# Altium schematic sheet Matrix2.SchDoc
size A0
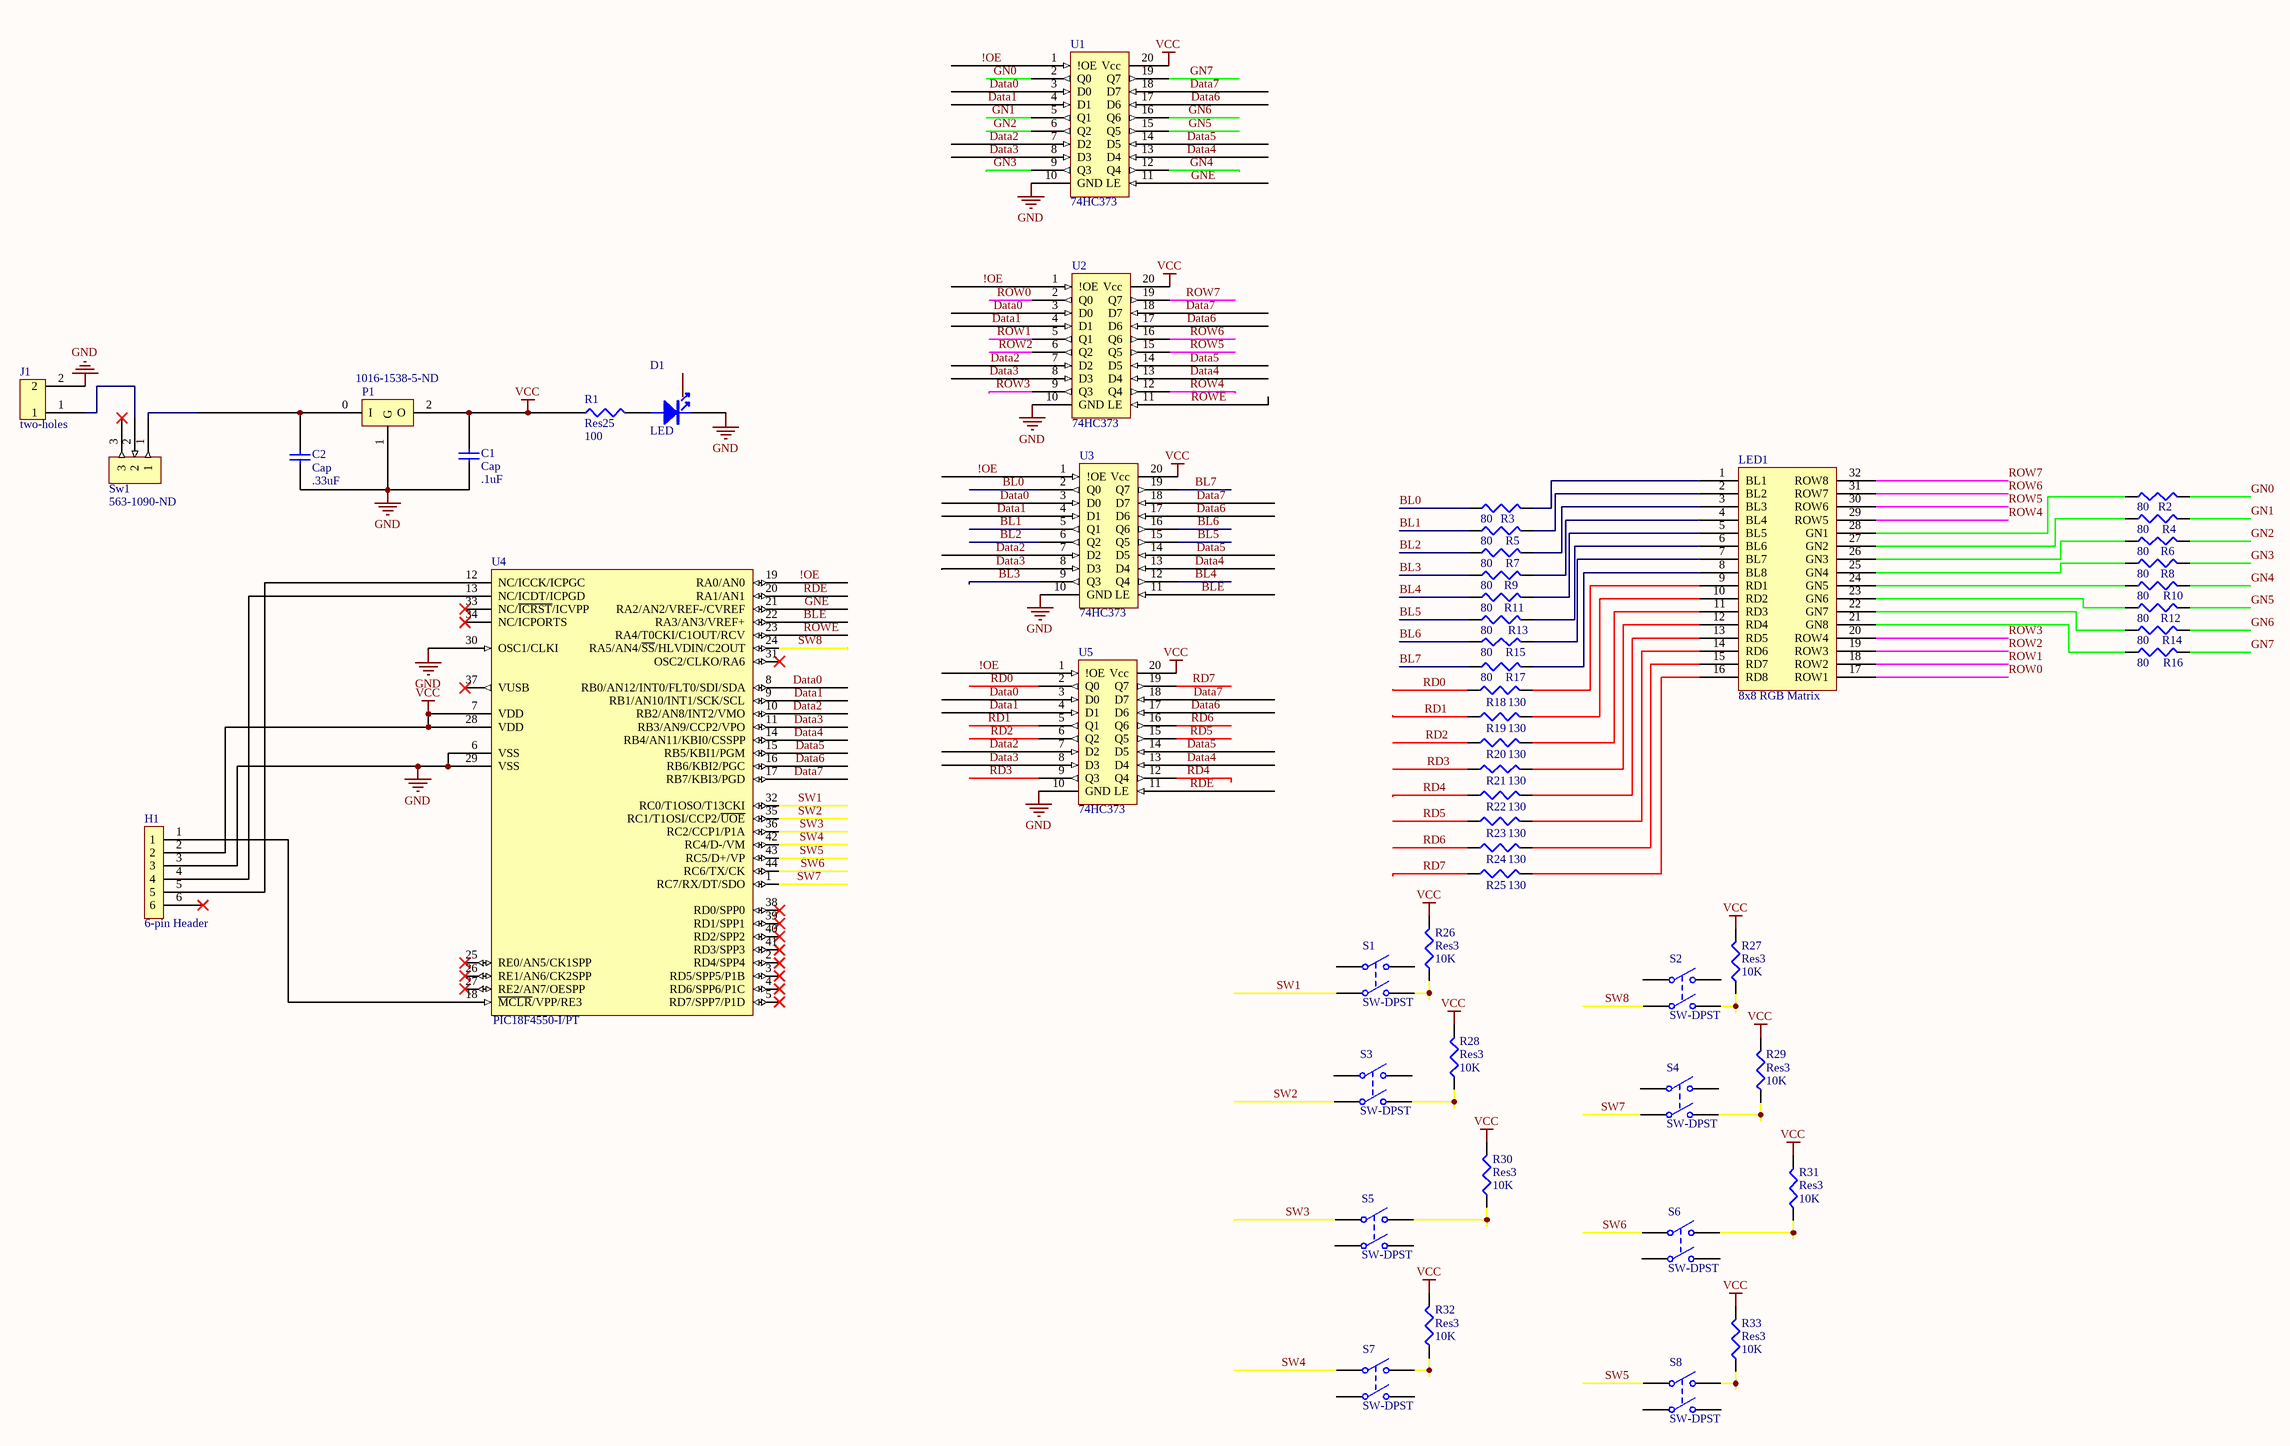
[diagram p0: Matrix2.SchDoc]

## Parts
C1  Cap  value .1uF  [RAD-0.3]
C2  Cap  value .33uF  [RAD-0.3]
D1  LED  [LED-5608F]
H1  6-pin Header  [6-pin Header]
J1  two-holes  [two-holes]
LED1  8x8 RGB Matrix  [8x8 RGB Matrix]
P1  1016-1538-5-ND  [1016-1538-5-ND]
R1  Res25  value 100  [J1-0603]
R2  80  [AXIAL0.5]
R3  80  [AXIAL0.5]
R4  80  [AXIAL0.5]
R5  80  [AXIAL0.5]
R6  80  [AXIAL0.5]
R7  80  [AXIAL0.5]
R8  80  [AXIAL0.5]
R9  80  [AXIAL0.5]
R10  80  [AXIAL0.5]
R11  80  [AXIAL0.5]
R12  80  [AXIAL0.5]
R13  80  [AXIAL0.5]
R14  80  [AXIAL0.5]
R15  80  [AXIAL0.5]
R16  80  [AXIAL0.5]
R17  80  [AXIAL0.5]
R18  value 130  [J1-0603]  (hidden comment: Res3)
R19  value 130  [J1-0603]  (hidden comment: Res3)
R20  value 130  [J1-0603]  (hidden comment: Res3)
R21  value 130  [J1-0603]  (hidden comment: Res3)
R22  value 130  [J1-0603]  (hidden comment: Res3)
R23  value 130  [J1-0603]  (hidden comment: Res3)
R24  value 130  [J1-0603]  (hidden comment: Res3)
R25  value 130  [J1-0603]  (hidden comment: Res3)
R26  Res3  value 10K  [J1-0603]
R27  Res3  value 10K  [J1-0603]
R28  Res3  value 10K  [J1-0603]
R29  Res3  value 10K  [J1-0603]
R30  Res3  value 10K  [J1-0603]
R31  Res3  value 10K  [J1-0603]
R32  Res3  value 10K  [J1-0603]
R33  Res3  value 10K  [J1-0603]
S1  SW-DPST  [DPST-4]
S2  SW-DPST  [DPST-4]
S3  SW-DPST  [DPST-4]
S4  SW-DPST  [DPST-4]
S5  SW-DPST  [DPST-4]
S6  SW-DPST  [DPST-4]
S7  SW-DPST  [DPST-4]
S8  SW-DPST  [DPST-4]
Sw1  563-1090-ND  [563-1090-ND]
U1  74HC373  [74HC373]
U2  74HC373  [74HC373]
U3  74HC373  [74HC373]
U4  PIC18F4550-I/PT  [TQFP-PT44_N]
U5  74HC373  [74HC373]

## Nets
GND: C1.1 C2.1 D1.K H1.3 J1.2 P1.1(G) U1.10(GND) U2.10(GND) U3.10(GND) U4.6(VSS) U4.29(VSS) U4.30(OSC1/CLKI) U5.10(GND)
VCC: C1.2 H1.2 P1.2(O) R1.1 R26.2 R27.2 R28.2 R29.2 R30.2 R31.2 R32.2 R33.2 U1.20(Vcc) U2.20(Vcc) U3.20(Vcc) U4.7(VDD) U4.28(VDD) U5.20(Vcc)
!OE: U1.1(!OE) U2.1(!OE) U3.1(!OE) U4.19(RA0/AN0) U5.1(!OE)
BL0: R3.1 U3.2(Q0)
BL1: R5.1 U3.5(Q1)
BL2: R7.1 U3.6(Q2)
BL3: R9.1 U3.9(Q3)
BL4: R11.1 U3.12(Q4)
BL5: R13.1 U3.15(Q5)
BL6: R15.1 U3.16(Q6)
BL7: R17.1 U3.19(Q7)
BLE: U3.11(LE) U4.22(RA3/AN3/VREF+)
Data0: U1.3(D0) U2.3(D0) U3.3(D0) U4.8(RB0/AN12/INT0/FLT0/SDI/SDA) U5.3(D0)
Data1: U1.4(D1) U2.4(D1) U3.4(D1) U4.9(RB1/AN10/INT1/SCK/SCL) U5.4(D1)
Data2: U1.7(D2) U2.7(D2) U3.7(D2) U4.10(RB2/AN8/INT2/VMO) U5.7(D2)
Data3: U1.8(D3) U2.8(D3) U3.8(D3) U4.11(RB3/AN9/CCP2/VPO) U5.8(D3)
Data4: U1.13(D4) U2.13(D4) U3.13(D4) U4.14(RB4/AN11/KBI0/CSSPP) U5.13(D4)
Data5: U1.14(D5) U2.14(D5) U3.14(D5) U4.15(RB5/KBI1/PGM) U5.14(D5)
Data6: U1.17(D6) U2.17(D6) U3.17(D6) U4.16(RB6/KBI2/PGC) U5.17(D6)
Data7: U1.18(D7) U2.18(D7) U3.18(D7) U4.17(RB7/KBI3/PGD) U5.18(D7)
GN0: R2.2 U1.2(Q0)
GN1: R4.2 U1.5(Q1)
GN2: R6.2 U1.6(Q2)
GN3: R8.2 U1.9(Q3)
GN4: R10.2 U1.12(Q4)
GN5: R12.2 U1.15(Q5)
GN6: R14.2 U1.16(Q6)
GN7: R16.2 U1.19(Q7)
GNE: U1.11(LE) U4.21(RA2/AN2/VREF-/CVREF)
RD0: R18.1 U5.2(Q0)
RD1: R19.1 U5.5(Q1)
RD2: R20.1 U5.6(Q2)
RD3: R21.1 U5.9(Q3)
RD4: R22.1 U5.12(Q4)
RD5: R23.1 U5.15(Q5)
RD6: R24.1 U5.16(Q6)
RD7: R25.1 U5.19(Q7)
RDE: U4.20(RA1/AN1) U5.11(LE)
ROW0: LED1.17(ROW1) U2.2(Q0)
ROW1: LED1.18(ROW2) U2.5(Q1)
ROW2: LED1.19(ROW3) U2.6(Q2)
ROW3: LED1.20(ROW4) U2.9(Q3)
ROW4: LED1.29(ROW5) U2.12(Q4)
ROW5: LED1.30(ROW6) U2.15(Q5)
ROW6: LED1.31(ROW7) U2.16(Q6)
ROW7: LED1.32(ROW8) U2.19(Q7)
ROWE: U2.11(LE) U4.23(RA4/T0CKI/C1OUT/RCV)
SW1: S1.3(COMMON2) U4.32(RC0/T1OSO/T13CKI)
SW2: S3.3(COMMON2) U4.35(RC1/T1OSI/CCP2/~{UOE})
SW3: S5.1(COMMON1) U4.36(RC2/CCP1/P1A)
SW4: S7.1(COMMON1) U4.42(RC4/D-/VM)
SW5: S8.1(COMMON1) U4.43(RC5/D+/VP)
SW6: S6.1(COMMON1) U4.44(RC6/TX/CK)
SW7: S4.3(COMMON2) U4.1(RC7/RX/DT/SDO)
SW8: S2.3(COMMON2) U4.24(RA5/AN4/~{SS}/HLVDIN/C2OUT)
NetC2_2: C2.2 P1.0(I) Sw1.1
NetD1_A: D1.A R1.2
NetH1_1: H1.1 U4.18(~{MCLR}/VPP/RE3)
NetH1_4: H1.4 U4.13(NC/ICDT/ICPGD)
NetH1_5: H1.5 U4.12(NC/ICCK/ICPGC)
NetJ1_1: J1.1 Sw1.2
NetLED1_1: LED1.1(BL1) R3.2
NetLED1_2: LED1.2(BL2) R5.2
NetLED1_3: LED1.3(BL3) R7.2
NetLED1_4: LED1.4(BL4) R9.2
NetLED1_5: LED1.5(BL5) R11.2
NetLED1_6: LED1.6(BL6) R13.2
NetLED1_7: LED1.7(BL7) R15.2
NetLED1_8: LED1.8(BL8) R17.2
NetLED1_9: LED1.9(RD1) R18.2
NetLED1_10: LED1.10(RD2) R19.2
NetLED1_11: LED1.11(RD3) R20.2
NetLED1_12: LED1.12(RD4) R21.2
NetLED1_13: LED1.13(RD5) R22.2
NetLED1_14: LED1.14(RD6) R23.2
NetLED1_15: LED1.15(RD7) R24.2
NetLED1_16: LED1.16(RD8) R25.2
NetLED1_21: LED1.21(GN8) R16.1
NetLED1_22: LED1.22(GN7) R14.1
NetLED1_23: LED1.23(GN6) R12.1
NetLED1_24: LED1.24(GN5) R10.1
NetLED1_25: LED1.25(GN4) R8.1
NetLED1_26: LED1.26(GN3) R6.1
NetLED1_27: LED1.27(GN2) R4.1
NetLED1_28: LED1.28(GN1) R2.1
NetR26_1: R26.1 S1.4(NO2)
NetR27_1: R27.1 S2.4(NO2)
NetR28_1: R28.1 S3.4(NO2)
NetR29_1: R29.1 S4.4(NO2)
NetR30_1: R30.1 S5.2(NO1)
NetR31_1: R31.1 S6.2(NO1)
NetR32_1: R32.1 S7.2(NO1)
NetR33_1: R33.1 S8.2(NO1)

Not connected (* = marked no-connect by the designer): H1 6*; S1 1(COMMON1) 2(NO1); S2 1(COMMON1) 2(NO1); S3 1(COMMON1) 2(NO1); S4 1(COMMON1) 2(NO1); S5 3(COMMON2) 4(NO2); S6 3(COMMON2) 4(NO2); S7 3(COMMON2) 4(NO2); S8 3(COMMON2) 4(NO2); Sw1 3*; U4 2(RD4/SPP4)* 3(RD5/SPP5/P1B)* 4(RD6/SPP6/P1C)* 5(RD7/SPP7/P1D)* 25(RE0/AN5/CK1SPP)* 26(RE1/AN6/CK2SPP)* 27(RE2/AN7/OESPP)* 31(OSC2/CLKO/RA6)* 33(NC/~{ICRST}/ICVPP)* 34(NC/ICPORTS)* 37(VUSB)* 38(RD0/SPP0)* 39(RD1/SPP1)* 40(RD2/SPP2)* 41(RD3/SPP3)*

## Library data of the parts
C1 C2 = Cap: Capacitor; Published: 8-Jun-2000; LatestRevisionDate: 17-Jul-2002; LatestRevisionNote: Re-released for DXP Platform.; PackageReference: RAD-0.3; Publisher: Altium Limited; PackageDescription: Radial Cap, Thru-Hole; 2 Leads; 0.3 in Pin Spacing
D1 = LED: Light Emitting Diode LED
R1 R18-R33 = Res3: Resistor; Published: 8-Jun-2000; LatestRevisionDate: 29-May-2009; LatestRevisionNote: IPC-7351 Footprint Added.; PackageReference: J1-0603; Publisher: Altium Limited; PackageDescription: Chip Resistor
R2-R17 = RES1
S1-S8 = SW-DPST: Double-Pole, Single-Throw Switch; Published: 24-Mar-1999; LatestRevisionDate: 17-Jul-2002; LatestRevisionNote: Re-released for DXP Platform.; PackageReference: DPST-4; Publisher: Altium Limited; PackageDescription: Switch; 4 Leads
U4 = PIC18F4550-I/PT: High Performance, Enhanced Flash, USB Microcontroller with nanoWatt Technology, 32K Flash, 44-Pin TQFP, Industrial Temperature Range; Published: 29-Jan-2009; LatestRevisionDate: 02-Dec-2009; LatestRevisionNote: Updated to datasheet revision E, Aug-2008; DatasheetVersion: revE, Aug-2008; PackageVersion: revBB, Aug-2009; PackageReference: TQFP-PT44; Publisher: Altium Limited; PackageDescription: 44-Lead Plastic Thin Quad Flatpack (PT) - 10x10x1mm Body, 2.00mm [TQFP]; Supplier 1: Digi-Key; Supplier Part Number 1: PIC18F4550-I/PT-ND; Supplier 2: Farnell; Supplier Part Number 2: 9321365; Supplier 3: Farnell; Supplier Part Number 3: 1528447; Code_JEDEC: MS-026; ComponentLink1Description: Datasheet; ComponentLink1URL: http://ww1.microchip.com/downloads/en/DeviceDoc/39632e.pdf; ComponentLink2Description: Packaging Specification; ComponentLink2URL: http://www.microchip.com/stellent/groups/techpub_sg/documents/packagingspec/en012702.pdf; ComponentLink3Description: Microchip.com Home; ComponentLink3URL: http://www.microchip.com/